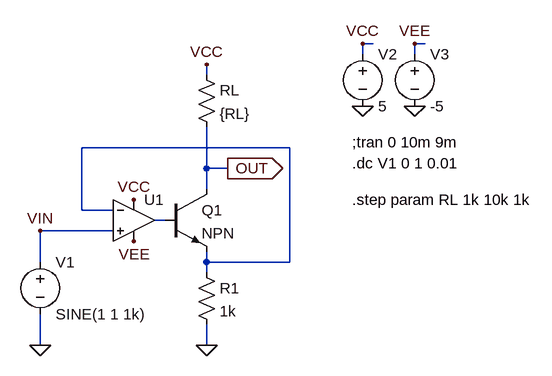
[diagram p0: schematic V-I Convert NPN.asc]
V-I Convert NPN.asc, the LTspice schematic file:
Version 4
SHEET 1 1028 680
WIRE 672 -160 656 -160
WIRE 752 -160 736 -160
WIRE 656 -144 656 -160
WIRE 736 -144 736 -160
WIRE 416 -112 416 -128
WIRE 544 0 224 0
WIRE 416 32 416 -32
WIRE 448 32 416 32
WIRE 416 64 416 32
WIRE 224 96 224 0
WIRE 272 96 224 96
WIRE 352 112 336 112
WIRE 272 128 160 128
WIRE 160 176 160 128
WIRE 416 176 416 160
WIRE 544 176 544 0
WIRE 544 176 416 176
WIRE 416 192 416 176
WIRE 160 304 160 256
WIRE 416 304 416 272
FLAG 160 304 0
FLAG 304 80 VCC
FLAG 304 144 VEE
FLAG 656 -64 0
FLAG 736 -64 0
FLAG 656 -160 VCC
FLAG 736 -160 VEE
FLAG 448 32 OUT
IOPIN 448 32 Out
FLAG 160 128 VIN
FLAG 416 -128 VCC
FLAG 416 304 0
SYMBOL voltage 160 160 R0
WINDOW 123 0 0 Left 2
WINDOW 39 0 0 Left 2
SYMATTR InstName V1
SYMATTR Value SINE(1 1 1k)
SYMBOL Opamps\\UniversalOpamp2 304 112 R0
SYMATTR InstName U1
SYMBOL res 400 176 R0
SYMATTR InstName R1
SYMATTR Value 1k
SYMBOL voltage 656 -160 R0
WINDOW 123 0 0 Left 2
WINDOW 39 0 0 Left 2
SYMATTR InstName V2
SYMATTR Value 5
SYMBOL voltage 736 -160 R0
WINDOW 123 0 0 Left 2
WINDOW 39 0 0 Left 2
SYMATTR InstName V3
SYMATTR Value -5
SYMBOL npn 352 64 R0
SYMATTR InstName Q1
SYMBOL res 400 -128 R0
SYMATTR InstName RL
SYMATTR Value {RL}
TEXT 640 -8 Left 2 !;tran 0 10m 9m
TEXT 640 24 Left 2 !.dc V1 0 1 0.01
TEXT 640 80 Left 2 !.step param RL 1k 10k 1k

The netlist it stands for:
* V-I Convert NPN.asc
V1 VIN 0 SINE(1 1 1k)
XU1 VIN N001 VCC VEE N002 level.2 Avol=1Meg GBW=10Meg Slew=10Meg ilimit=25m rail=0 Vos=0 phimargin=45 en=0 enk=0 in=0 ink=0 Rin=500Meg  ; pins IN+ IN- V+ V- OUT
R1 N001 0 1k
V2 VCC 0 5
V3 VEE 0 -5
Q1 OUT N002 N001 0 NPN
RL VCC OUT {RL}
.model NPN NPN
.model PNP PNP
.lib standard.bjt
;tran 0 10m 9m
.dc V1 0 1 0.01
.step param RL 1k 10k 1k
.lib UniversalOpamps2.sub
.backanno
.end